# EAGLE design TSOC_GROVEY_WIFI_R0_1 (EAGLE 6.6.0)
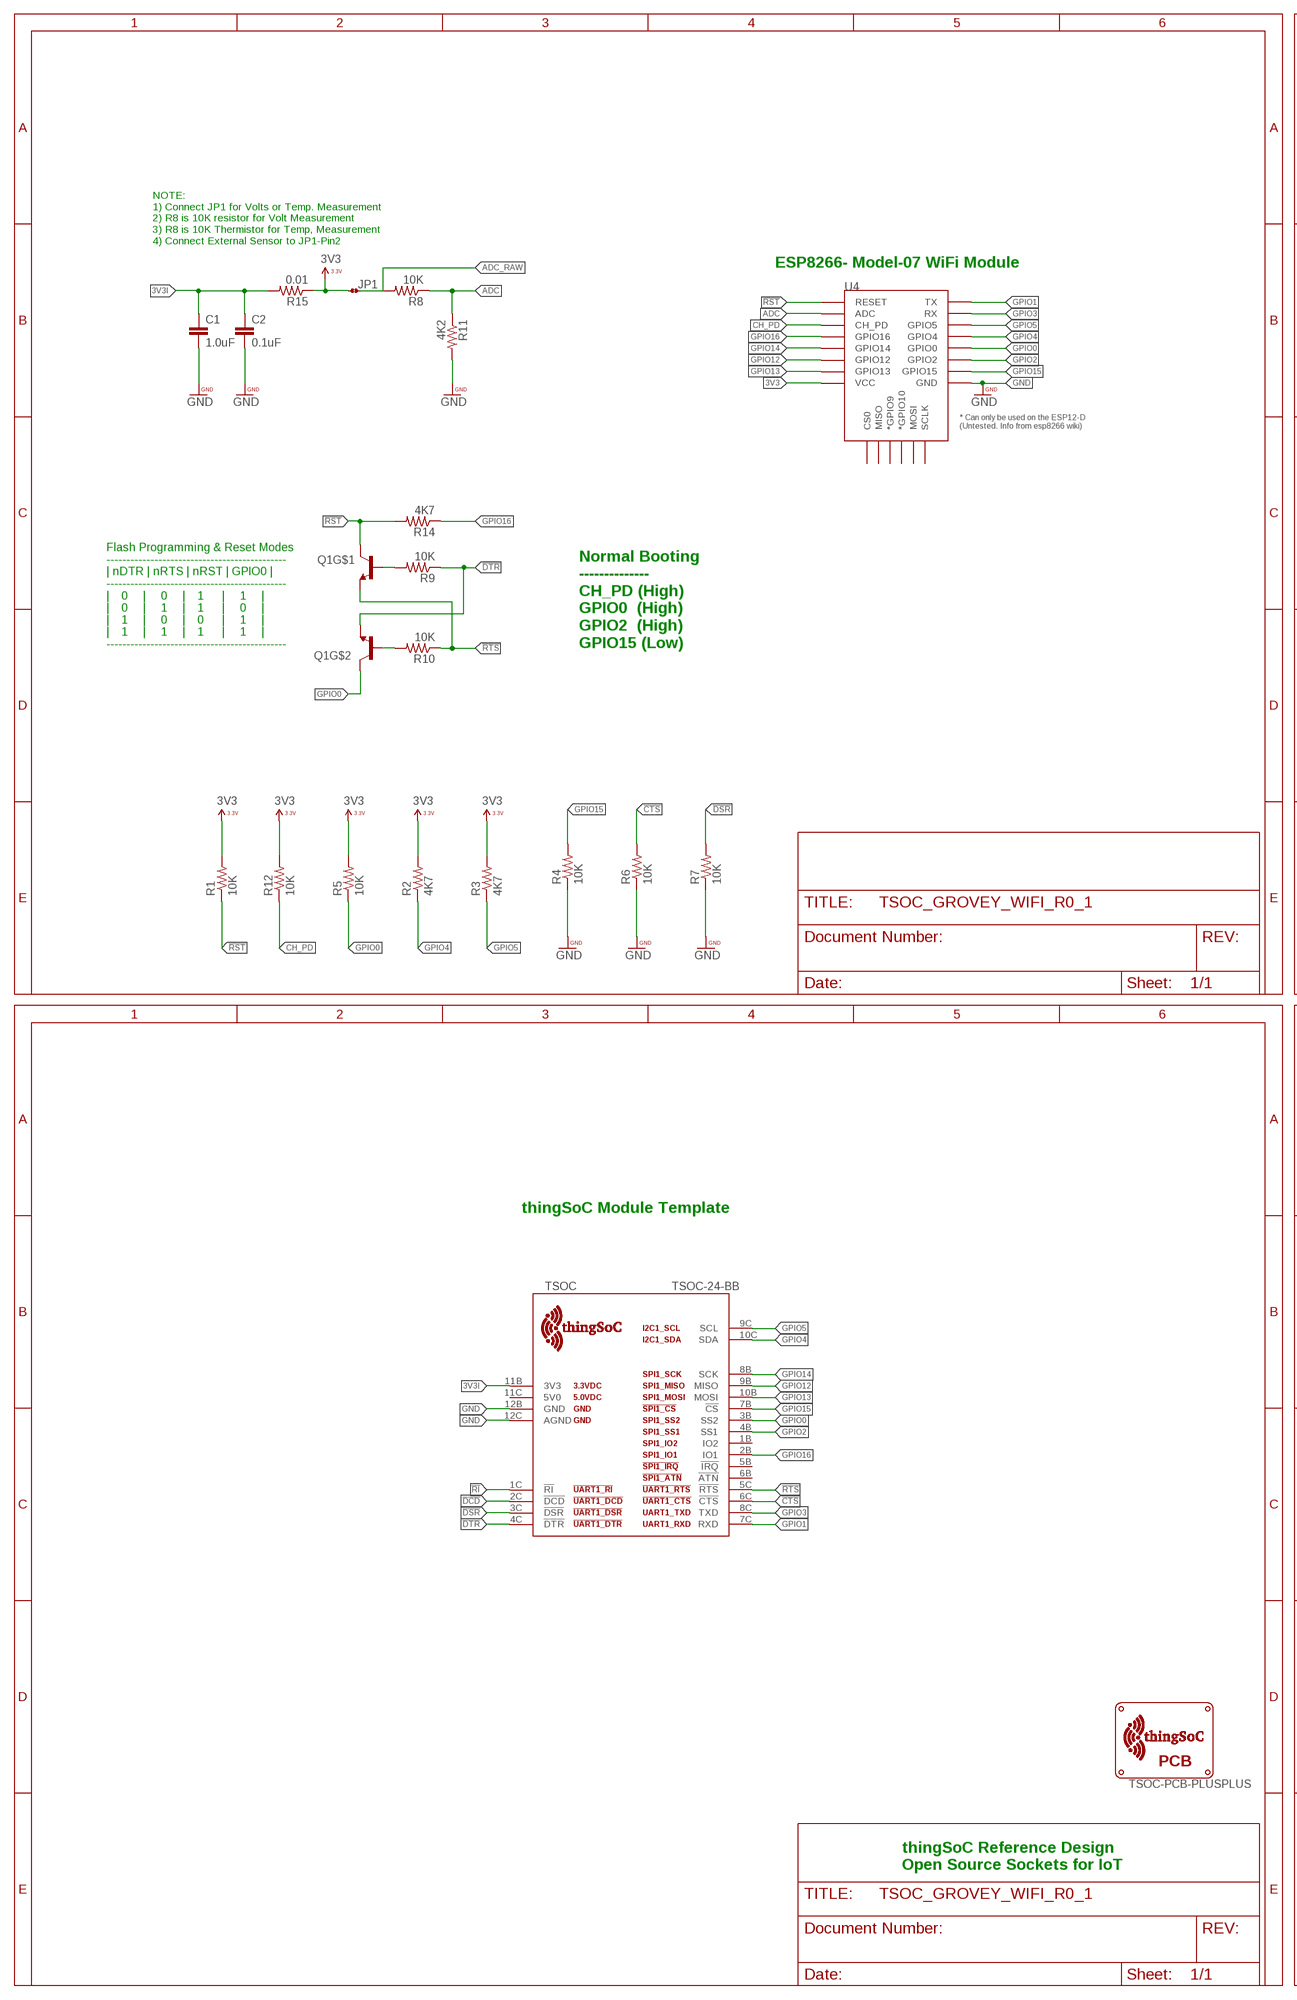
[diagram p0: schematic, sheet 1, part 1 of 2]
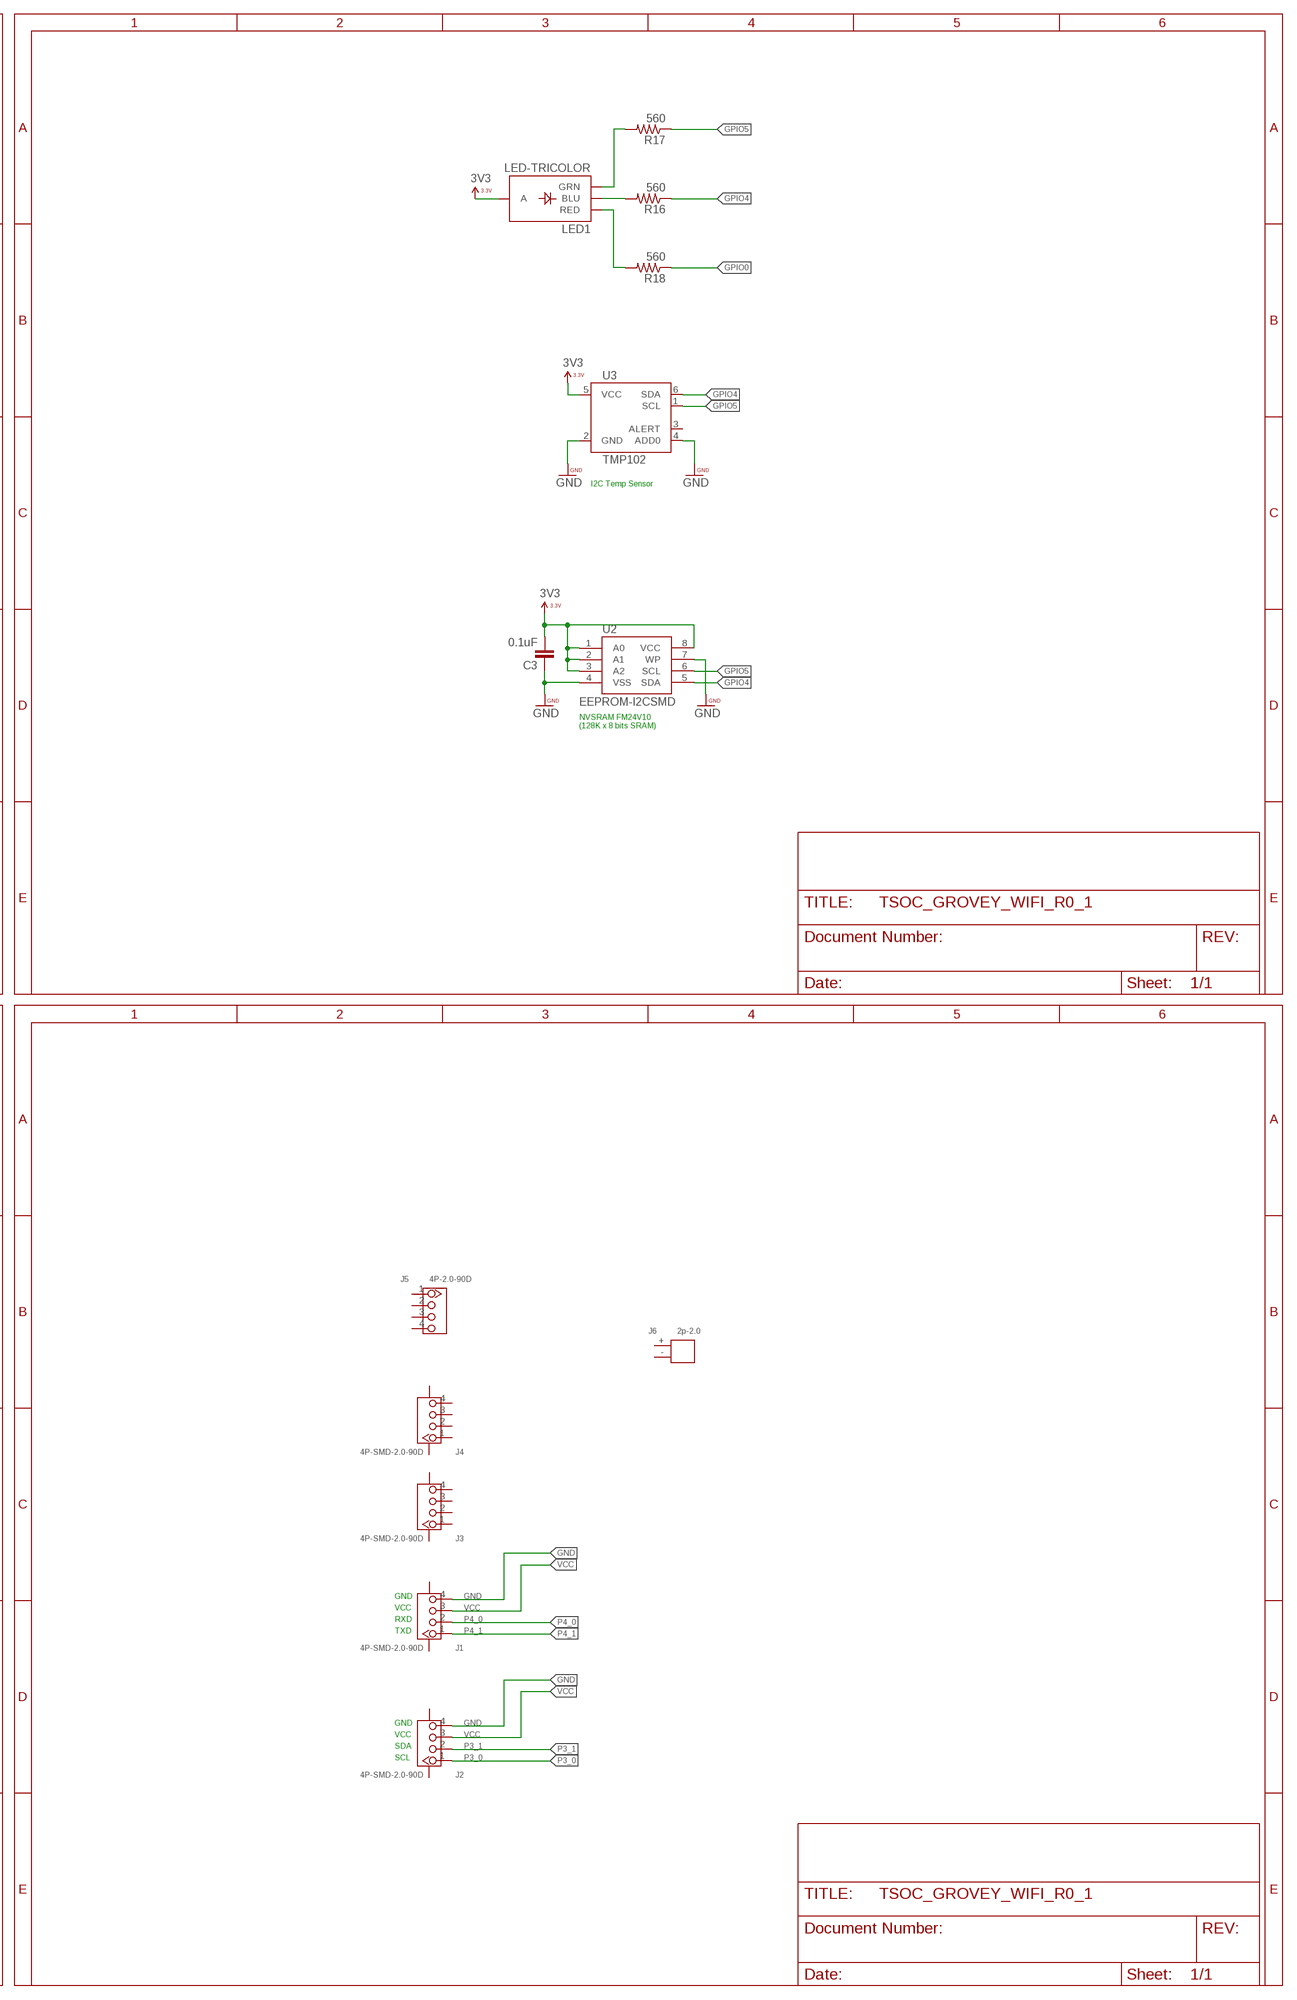
[diagram p1: schematic, sheet 1, part 2 of 2]

## Parts
C1  1.0uF  CAP0402-CAP  [0402-CAP]
C2  0.1uF  CAP0402-CAP  [0402-CAP]
C3  0.1uF  CAP0402-CAP  [0402-CAP]
J1  4P-SMD-2.0-90D  GROVE-CONNECTOR-SMD-90D(4+2P-2.0)  [HW4-SMD-2.0-90D]
J2  4P-SMD-2.0-90D  GROVE-CONNECTOR-SMD-90D(4+2P-2.0)  [HW4-SMD-2.0-90D]
J3  4P-SMD-2.0-90D  GROVE-CONNECTOR-SMD-90D(4+2P-2.0)  [HW4-SMD-2.0-90D]
J4  4P-SMD-2.0-90D  GROVE-CONNECTOR-SMD-90D(4+2P-2.0)  [HW4-SMD-2.0-90D]
J5  4P-2.0-90D  GROVE-CONNECTOR-DIP-90D(4P-2.0)  [HW4-2.0-90D]
J6  2p-2.0  DIP-JST-2P-2.0  [H2-2.0-6X4.5MM]
JP1  JMP-2-NO-0402  [JMP-2-NO-0402]
LED1  LED-TRICOLOR  [LED-TRICOLOR-SMD]
Q1  MMBT2222A  MMDT3904  [SOT363]
R1  10K  RESISTOR0402  [0402-RES]
R2  4K7  RESISTOR0402  [0402-RES]
R3  4K7  RESISTOR0402  [0402-RES]
R4  10K  RESISTOR0402  [0402-RES]
R5  10K  RESISTOR0402  [0402-RES]
R6  10K  RESISTOR0402  [0402-RES]
R7  10K  RESISTOR0402  [0402-RES]
R8  10K  RESISTOR0402  [0402-RES]
R9  10K  RESISTOR0402  [0402-RES]
R10  10K  RESISTOR0402  [0402-RES]
R11  4K2  RESISTOR0402  [0402-RES]
R12  10K  RESISTOR0402  [0402-RES]
R14  4K7  RESISTOR0402  [0402-RES]
R15  0.01  RESISTOR0402  [0402-RES]
R16  560  RESISTOR0402  [0402-RES]
R17  560  RESISTOR0402  [0402-RES]
R18  560  RESISTOR0402  [0402-RES]
TSOC  TSOC-24-BB  [TSOC-BB-S24]
U2  EEPROM-I2CSMD  [SO08]
U3  TMP102  [SOT563]
U4  ESP12ESMD  [ESP12E-SMD]
U$11  TSOC-PCB-PLUSPLUS  [TSOC-BB-BRD-PLUS-PLUS-DIM]

## Nets
3V3: C3.2 JP1.1 LED1.A R1.2 R2.2 R3.2 R5.2 R12.2 R15.1 U2.1(A0) U2.2(A1) U2.3(A2) U2.8(VCC) U3.5(VCC) U4.VCC
3V3I: C1.1 C2.1 R15.2 TSOC.11B(3V3)
!CTS: R6.2 TSOC.6C(!CTS)
!DCD: TSOC.2C(!DCD)
!DSR: R7.2 TSOC.3C(!DSR)
!DTR: Q1.1(E) R9.1 TSOC.4C(!DTR)
!RI: TSOC.1C(!RI)
!RST: Q1.3(C) R1.1 R14.2 U4.RESET
!RTS: Q1.4(E) R10.1 TSOC.5C(!RTS)
ADC: R8.1 R11.1 U4.ADC
ADC_RAW: JP1.2 R8.2
BLU: LED1.B(BLU) R16.2
CH_PD: R12.1 U4.CH_PD
GND: C1.2 C2.2 C3.1 J1.4 J2.4 R4.1 R6.1 R7.1 R11.2 TSOC.12B(GND) TSOC.12C(AGND) U2.4(VSS) U2.7(WP) U3.2(GND) U3.4(ADD0) U4.GND
GPIO0: Q1.6(C) R5.1 R18.1 TSOC.3B(SS2) U4.GPIO0
GPIO1: TSOC.7C(RXD) U4.TXD0(TX)
GPIO2: TSOC.4B(SS1) U4.GPIO2
GPIO3: TSOC.8C(TXD) U4.RXD0(RX)
GPIO4: R2.1 R16.1 TSOC.10C(SDA) U2.5(SDA) U3.6(SDA) U4.GPIO4
GPIO5: R3.1 R17.1 TSOC.9C(SCL) U2.6(SCL) U3.1(SCL) U4.GPIO5
GPIO12: TSOC.9B(MISO) U4.GPIO12
GPIO13: TSOC.10B(MOSI) U4.GPIO13
GPIO14: TSOC.8B(SCK) U4.GPIO14
GPIO15: R4.2 TSOC.7B(!CS) U4.GPIO15
GPIO16: R14.1 TSOC.2B(IO1) U4.GPIO16
GRN: LED1.G(GRN) R17.2
N$6: Q1.5(B) R9.2
N$12: Q1.2(B) R10.2
P3_0: J2.1
P3_1: J2.2
P4_0: J1.2
P4_1: J1.1
RED: LED1.R(RED) R18.2
VCC: J1.3 J2.3
Unconnected: J1.SS1 J1.SS2 J2.SS1 J2.SS2 J3.1 J3.2 J3.3 J3.4 J3.SS1 J3.SS2 J4.1 J4.2 J4.3 J4.4 J4.SS1 J4.SS2 J5.1 J5.2 J5.3 J5.4 J6.+ J6.- TSOC.1B(IO2) TSOC.5B(!IRQ) TSOC.6B(!ATN) TSOC.11C(5V0) U3.3(ALERT) U4.CS0 U4.GPIO9(*GPIO9) U4.GPIO10(*GPIO10) U4.MISO U4.MOSI U4.SCLK

## Notes on the sheet
- NOTE:
  1) Connect JP1 for Volts or Temp. Measurement
  2) R8 is 10K resistor for Volt Measurement
  3) R8 is 10K Thermistor for Temp, Measurement
  4) Connect External Sensor to JP1-Pin2
- ESP8266- Model-07 WiFi Module
- I2C Temp Sensor
- Flash Programming & Reset Modes
  ---------------------------------------------
  | nDTR | nRTS | nRST | GPIO0 |
  ---------------------------------------------
  |    0     |     0     |    1      |     1     |
  |    0     |     1     |    1      |     0     |
  |    1     |     0     |    0      |     1     |
  |    1     |     1     |    1      |     1     |
  ---------------------------------------------
- Normal Booting
  --------------
  CH_PD (High)
  GPIO0  (High)
  GPIO2  (High) 
  GPIO15 (Low)
- NVSRAM FM24V10
  (128K x 8 bits SRAM)
- thingSoC Module Template
- GND
- VCC
- RXD
- TXD
- GND
- VCC
- SDA
- SCL
- thingSoC Reference Design
  Open Source Sockets for IoT

## Library data of the parts
C1-C3 = PatternAgents-ProtoPads:CAP: Capacitor Standard 0603 ceramic capacitor, and 0.1" leaded capacitor.
J1-J4 = Seeed-Connector -2016:GROVE-CONNECTOR-SMD-90D(4+2P-2.0): 320110032
J5 = Seeed-Connector -2016:GROVE-CONNECTOR-DIP-90D(4P-2.0): 320110034
J6 = Seeed-Connector -2016:DIP-JST-2P-2.0: 320110049
JP1 = PatternAgents-ProtoPads:JMP-2-NO: Two Terminal Jumper - Normally Open Positions 1 and 2 are normally NOT connected. PatternAgents ProtoPads Library Schematic and PCB layout libraries for design patterns by PatternAgents. For the CADSoft Eagle CAD program : http://www.cadsoftusa.com/download-eagle/ Source LBR : http://www.patternagents.com Github : https://github.com/PatternAgents License : http://creativecommons.org/licenses/by-sa/4.0/ (Creative Commons 4.0) THIS SOFTWARE IS PROVIDED BY THE CONTRIBUTORS "AS IS" AND WITHOUT ANY EXPRESS OR IMPLIED WARRANTIES, INCLUDING, BUT NOT LIMITED TO, THE IMPLIED WARRANTIES OF MERCHANTABILITY AND FITNESS FOR A PARTICULAR PURPOSE ARE DISCLAIMED. IN NO EVENT SHALL THE COPYRIGHT OWNER OR CONTRIBUTORS BE LIABLE FOR ANY DIRECT, INDIRECT, INCIDENTAL, SPECIAL, EXEMPLARY, OR CONSEQUENTIAL DAMAGES (INCLUDING, BUT NOT LIMITED TO, PROCUREMENT OF SUBSTITUTE GOODS OR SERVICES; LOSS OF USE, DATA, OR PROFITS; OR BUSINESS INTERRUPTION) HOWEVER CAUSED AND ON ANY THEORY OF LIABILITY, WHETHER IN CONTRACT, STRICT LIABILITY, OR TORT (INCLUDING NEGLIGENCE OR OTHERWISE) ARISING IN ANY WAY OUT OF THE USE OF THIS SOFTWARE, EVEN IF ADVISED OF THE POSSIBILITY OF SUCH DAMAGE.; BOM: EXCLUDE
LED1 = SparkFun-LED:LED-TRICOLOR: Tri-Color LED SMD Proven layout and schematic for triple color LED in SMD package - common anode. Spark Fun Electronics SKU : COM-07844
Q1 = SparkFun-DiscreteSemi:MMDT3904: Dual NPN transistor
R1-R12 R14-R18 = PatternAgents-ProtoPads:RESISTOR: Resistor Basic schematic elements and footprints for 0603, 1206, and PTH resistors.
TSOC = thingSoC:TSOC-24: thingSoC Twenty-Four(24) Pin Socket Source LBR : http://www.thingsoc.com Github : https://github.com/thingsoc License : http://creativecommons.org/licenses/by-sa/4.0/ (Creative Commons 4.0) THIS SOFTWARE IS PROVIDED BY THE CONTRIBUTORS "AS IS" AND WITHOUT ANY EXPRESS OR IMPLIED WARRANTIES, INCLUDING, BUT NOT LIMITED TO, THE IMPLIED WARRANTIES OF MERCHANTABILITY AND FITNESS FOR A PARTICULAR PURPOSE ARE DISCLAIMED. IN NO EVENT SHALL THE COPYRIGHT OWNER OR CONTRIBUTORS BE LIABLE FOR ANY DIRECT, INDIRECT, INCIDENTAL, SPECIAL, EXEMPLARY, OR CONSEQUENTIAL DAMAGES (INCLUDING, BUT NOT LIMITED TO, PROCUREMENT OF SUBSTITUTE GOODS OR SERVICES; LOSS OF USE, DATA, OR PROFITS; OR BUSINESS INTERRUPTION) HOWEVER CAUSED AND ON ANY THEORY OF LIABILITY, WHETHER IN CONTRACT, STRICT LIABILITY, OR TORT (INCLUDING NEGLIGENCE OR OTHERWISE) ARISING IN ANY WAY OUT OF THE USE OF THIS SOFTWARE, EVEN IF ADVISED OF THE POSSIBILITY OF SUCH DAMAGE.
U2 = SparkFun-DigitalIC:EEPROM-I2C: I2C EEPROM chips, 24LC256 (and others)
U3 = SparkFun-Sensors:TMP102: I2C degC temp sensor; PROD_ID: IC-09303
U4 = PatternAgents_RFmodules:ESP12E: ESP12E Module
U$11 = thingSoC:TSOC-PCB: thingSoC PCB Outlines Boards Outlines for Standard Sizes (in the DImension Layer) (Registration marks in the tDocu layer - make sure to turn on tDocu/bDocu) Source LBR : http://www.thingsoc.com Github : https://github.com/thingsoc License : http://creativecommons.org/licenses/by-sa/4.0/ (Creative Commons 4.0) THIS SOFTWARE IS PROVIDED BY THE CONTRIBUTORS "AS IS" AND WITHOUT ANY EXPRESS OR IMPLIED WARRANTIES, INCLUDING, BUT NOT LIMITED TO, THE IMPLIED WARRANTIES OF MERCHANTABILITY AND FITNESS FOR A PARTICULAR PURPOSE ARE DISCLAIMED. IN NO EVENT SHALL THE COPYRIGHT OWNER OR CONTRIBUTORS BE LIABLE FOR ANY DIRECT, INDIRECT, INCIDENTAL, SPECIAL, EXEMPLARY, OR CONSEQUENTIAL DAMAGES (INCLUDING, BUT NOT LIMITED TO, PROCUREMENT OF SUBSTITUTE GOODS OR SERVICES; LOSS OF USE, DATA, OR PROFITS; OR BUSINESS INTERRUPTION) HOWEVER CAUSED AND ON ANY THEORY OF LIABILITY, WHETHER IN CONTRACT, STRICT LIABILITY, OR TORT (INCLUDING NEGLIGENCE OR OTHERWISE) ARISING IN ANY WAY OUT OF THE USE OF THIS SOFTWARE, EVEN IF ADVISED OF THE POSSIBILITY OF SUCH DAMAGE.

## Board
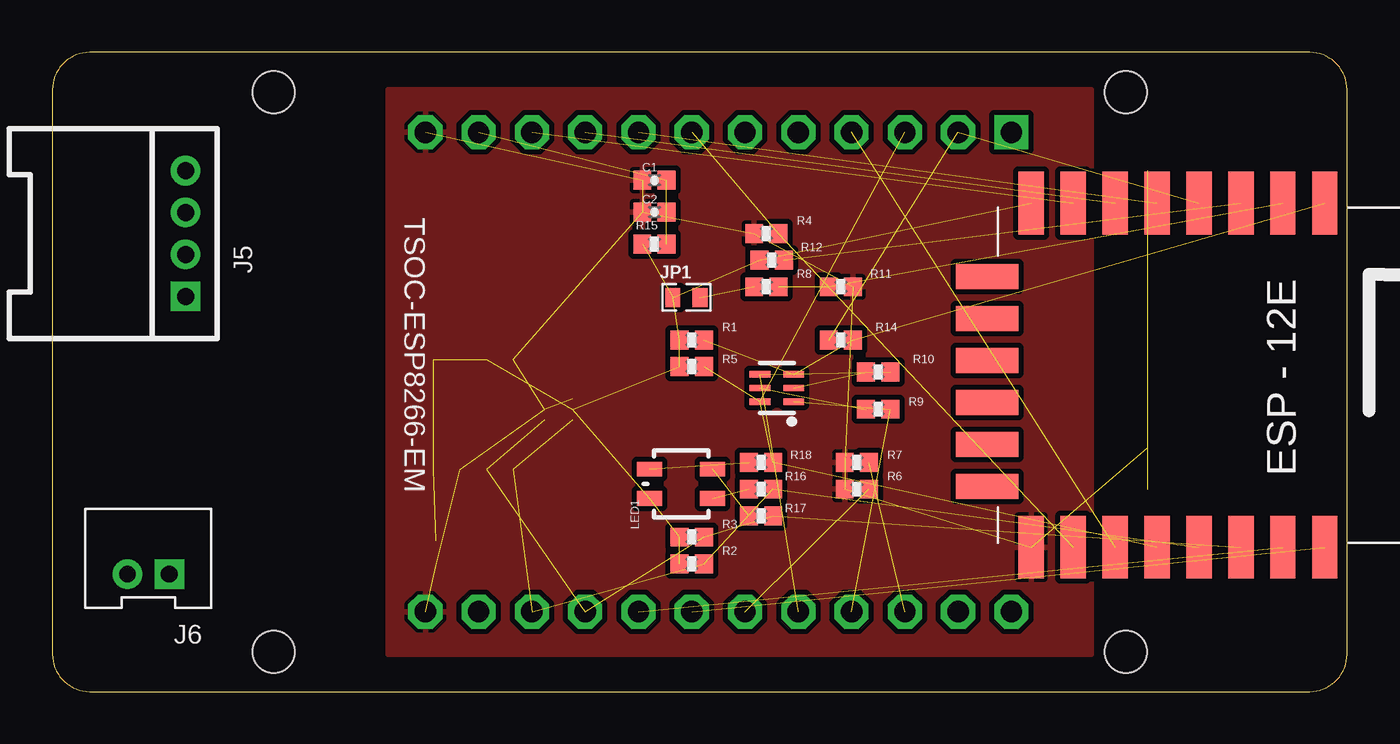
[diagram p2: board, top side]
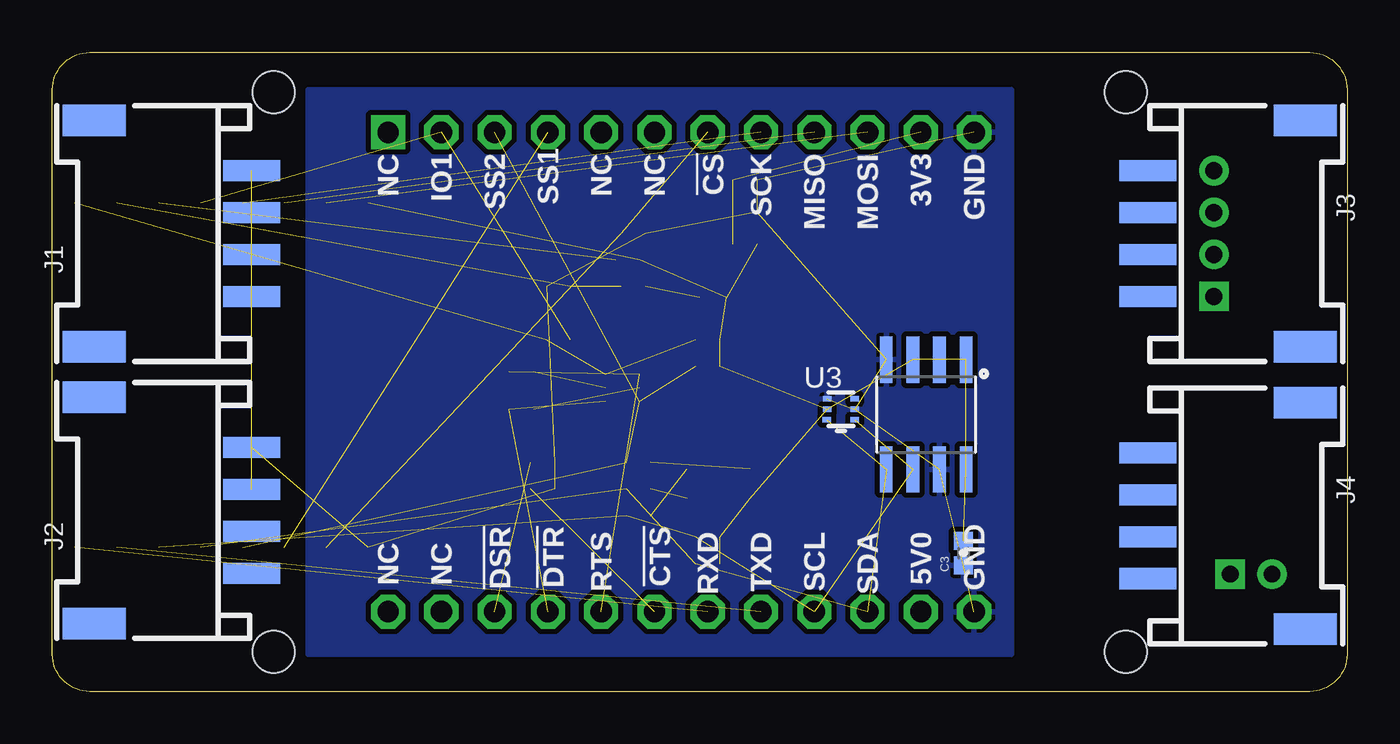
[diagram p3: board, bottom side, seen from below]

Size 61.72 x 30.48 mm. Coordinates in mm from the lower left corner, seen from the top.
Copper layers (1*16): Top 0.035mm / dielectric 1.5mm / Bottom 0.035mm
Design rules "PatternAgents_7mil": minimum track width 7mil, minimum drill 14mil, track to track 7mil, track to pad 7mil, pad to pad 7mil, via to via 7mil, smd to smd 7mil, copper to edge 7mil, drill to drill 7mil, minimum pad ring 12mil, minimum via ring 10mil, stop-mask expansion 4mil, vias tented up to drill 25mil, thermal gap 7mil

### Footprints (pad centres in the part's own frame; a part is rotated, then mirrored left to right if it is on the bottom)
0402-CAP = smd 0.85 x 0.9: 1 -0.58,0; 2 0.58,0
HW4-SMD-2.0-90D = smd 1.01 x 2.74: 1 -3,-0.1; 2 -1,-0.1; 3 1,-0.1; 4 3,-0.1 | smd 1.5 x 3: SS1 -5.4,7.4; SS2 5.4,7.4
HW4-2.0-90D = drill 0.8 pad 1.27 square: 1 -3,0 | drill 0.8 pad 1.27: 2 -1,0; 3 1,0; 4 3,0
H2-2.0-6X4.5MM = drill 0.8 pad 1.3 square: + -1,0.75 | drill 0.8 pad 1.3: - 1,0.75
JMP-2-NO-0402 = smd 0.7 x 0.9: 1 -0.65,0; 2 0.65,0
LED-TRICOLOR-SMD = smd 0.7 x 1.2: A 0.7,-1.5; B 0.7,1.5; G -0.7,1.5; R -0.7,-1.5
SOT363 = smd 0.3 x 0.99: 1 -0.65,-0.8; 2 0,-0.8; 3 0.65,-0.8; 4 0.65,0.81; 5 0,0.81; 6 -0.65,0.81
0402-RES = smd 0.85 x 0.9: 1 -0.58,0; 2 0.58,0
TSOC-BB-S24 = drill 1.016 square: 1B -11.43,11.43 | drill 1.016 octagon: 1C 11.43,11.43; 2B -11.43,8.89; 2C 11.43,8.89; 3B -11.43,6.35; 3C 11.43,6.35; 4B -11.43,3.81; 4C 11.43,3.81; 5B -11.43,1.27; 5C 11.43,1.27; 6B -11.43,-1.27; 6C 11.43,-1.27; 7B -11.43,-3.81; 7C 11.43,-3.81; 8B -11.43,-6.35; 8C 11.43,-6.35; 9B -11.43,-8.89; 9C 11.43,-8.89; 10B -11.43,-11.43; 10C 11.43,-11.43; 11B -11.43,-13.97; 11C 11.43,-13.97; 12B -11.43,-16.51; 12C 11.43,-16.51
SO08 = smd 0.61 x 2.21: 1 -1.905,-2.616; 2 -0.635,-2.616; 3 0.635,-2.616; 4 1.905,-2.616; 5 1.905,2.616; 6 0.635,2.616; 7 -0.635,2.616; 8 -1.905,2.616
SOT563 = smd 0.25 x 0.4: 1 -0.5,-0.66; 2 0,-0.66; 3 0.5,-0.66; 4 0.5,0.66; 5 0,0.66; 6 -0.5,0.67
ESP12E-SMD = smd 3 x 1.2: ADC -8.3,3.8; CH_PD -8.3,1.8; GND 8.1,-8.2; GPIO0 8.1,-2.2; GPIO2 8.1,-4.2; GPIO4 8.1,-0.2; GPIO5 8.1,1.8; GPIO12 -8.3,-4.2; GPIO13 -8.3,-6.2; GPIO14 -8.3,-2.2; GPIO15 8.1,-6.2; GPIO16 -8.3,-0.2; RESET -8.3,5.8; RXD0 8.1,3.8; TXD0 8.1,5.8; VCC -8.3,-8.2 | smd 1.2 x 3: CS0 -4.8,-10.3; GPIO9 -0.8,-10.3; GPIO10 1.2,-10.3; MISO -2.8,-10.3; MOSI 3.2,-10.3; SCLK 5.2,-10.3
TSOC-BB-BRD-PLUS-PLUS-DIM = hole 2: -13.335,-23.749; 13.335,-23.749; -13.335,16.891; 13.335,16.891

### Placement (x,y rotation side)
C1  28.7,24.38 180 top
C2  28.7,22.86 180 top
C3  18.29,6.6 90 bottom
J1  52.32,21.84 90 bottom
J2  52.32,8.64 90 bottom
J3  9.4,21.84 270 bottom
J4  9.4,8.38 270 bottom
J5  6.35,21.84 90 top
J6  4.57,6.35 180 top
JP1  30.23,18.8 0 top
LED1  29.97,9.91 270 top
Q1  34.54,14.48 90 top
R1  30.48,16.76 180 top
R2  30.48,6.1 180 top
R3  30.48,7.37 180 top
R4  34.04,21.84 0 top
R5  30.48,15.49 180 top
R6  38.35,9.65 0 top
R7  38.35,10.92 0 top
R8  34.04,19.3 180 top
R9  39.37,13.46 180 top
R10  39.37,15.24 180 top
R11  37.59,19.3 0 top
R12  34.29,20.57 180 top
R14  37.59,16.76 0 top
R15  28.7,21.34 0 top
R16  33.78,9.65 180 top
R17  33.78,8.38 180 top
R18  33.78,10.92 180 top
TSOC  34.29,15.24 270 top
U2  20.07,13.21 180 bottom
U3  24.13,13.46 90 bottom
U4  54.86,14.99 270 top
U$11  34.29,15.24 270 top

### Tracks (layer width: path | path; a pad name or v marks a point on that pad's centre or on a via)
3V3  (14 unrouted)
3V3I  (3 unrouted)
!CTS  (1 unrouted)
!DSR  (1 unrouted)
!DTR  (2 unrouted)
!RST  (3 unrouted)
!RTS  (2 unrouted)
ADC  (2 unrouted)
ADC_RAW  (1 unrouted)
BLU  (1 unrouted)
CH_PD  (1 unrouted)
GND  (15 unrouted)
  pour Bottom (isolate 0.254, hatched): 16,1.78 16,28.7 49.53,28.7 49.53,1.78
  pour Top (isolate 0.254, hatched): 16,1.78 16,28.7 49.53,28.7 49.53,1.78
GPIO0  (4 unrouted)
GPIO1  (1 unrouted)
GPIO2  (1 unrouted)
GPIO3  (1 unrouted)
GPIO4  (5 unrouted)
GPIO5  (5 unrouted)
GPIO12  (1 unrouted)
GPIO13  (1 unrouted)
GPIO14  (1 unrouted)
GPIO15  (2 unrouted)
GPIO16  (2 unrouted)
GRN  (1 unrouted)
N$6  (1 unrouted)
N$12  (1 unrouted)
RED  (1 unrouted)
VCC  (1 unrouted)

### Text on the board
tPlace: TSOC-ESP8266-EM
bPlace: GND | 3V3 | MOSI | MISO | SCK | !CS | NC | NC | SS1 | SS2 | IO1 | NC | U3 | 5V0 | SDA | SCL | TXD | RXD | !CTS | RTS | !DTR | !DSR | NC | NC | GND